# EAGLE design sop-dip-8 (EAGLE 4.16)
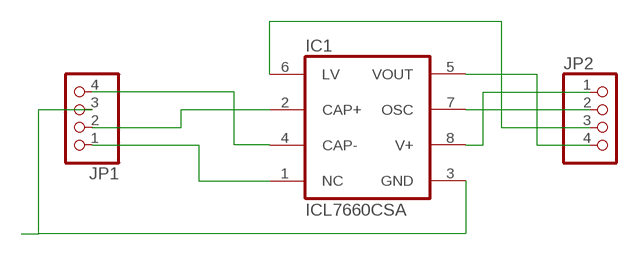
[diagram p0: schematic, sheet 1]

## Parts
IC1  ICL7660CSA  [SO08]
JP1  PINHD-1X4  [1X04]
JP2  PINHD-1X4  [1X04]

## Nets
N$1: IC1.1(NC) JP1.1
N$2: IC1.2(CAP+) JP1.2
N$3: IC1.3(GND) JP1.3
N$4: IC1.4(CAP-) JP1.4
N$5: IC1.5(VOUT) JP2.4
N$6: IC1.6(LV) JP2.3
N$7: IC1.7(OSC) JP2.2
N$8: IC1.8(V+) JP2.1

## Library data of the parts
IC1 = maxim-9:ICL7660CSA: VOLTAGE CONVERTER
JP1 JP2 = pinhead:PINHD-1X4: PIN HEADER

## Board
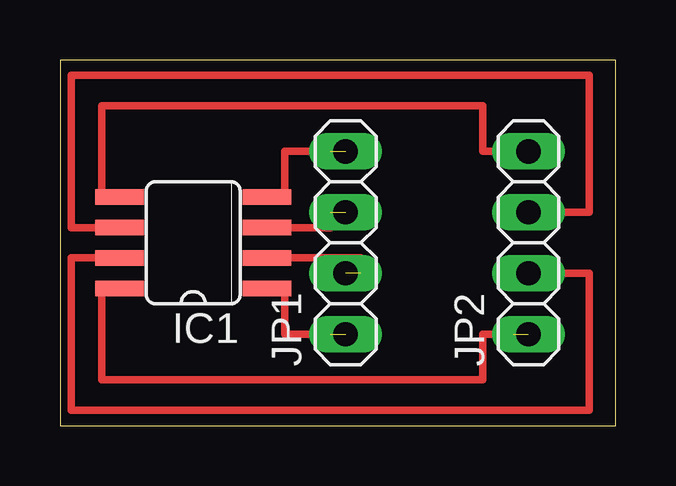
[diagram p1: board, top side]

Size 23.16 x 15.23 mm. Coordinates in mm from the lower left corner, seen from the top.
Outline: 0,0 23.16,0 23.16,15.23 0,15.23 0,0
Copper layers (1*16): Top 0.035mm / dielectric 1.5mm / Bottom 0.035mm
Design rules "default": minimum track width 10mil, minimum drill 24mil, track to track 8mil, track to pad 8mil, pad to pad 8mil, via to via 8mil, smd to smd 8mil, copper to edge 40mil, drill to drill 8mil, minimum pad ring 10mil, minimum via ring 8mil, stop-mask expansion 4mil, vias tented up to drill 0mil, thermal gap 10mil

### Footprints (pad centres in the part's own frame; a part is rotated, then mirrored left to right if it is on the bottom)
SO08 = smd 0.66 x 2.032: 1 -1.905,-3.073; 2 -0.635,-3.073; 3 0.635,-3.073; 4 1.905,-3.073; 5 1.905,3.073; 6 0.635,3.073; 7 -0.635,3.073; 8 -1.905,3.073
1X04 = drill 1.016 long: 1 -3.81,0; 2 -1.27,0; 3 1.27,0; 4 3.81,0

### Placement (x,y rotation side)
IC1  5.55,7.62 90 top
JP1  11.9,7.62 90 top
JP2  19.52,7.62 90 top

### Tracks (layer width: path | path; a pad name or v marks a point on that pad's centre or on a via)
N$1  (1 unrouted)
  Top 0.305: IC1.1 9.36,5.71 9.36,3.81 11.27,3.81
N$2  (1 unrouted)
  Top 0.305: IC1.2 12.54,6.98 12.54,6.35
N$3  (1 unrouted)
  Top 0.305: IC1.3 11.27,8.25 11.27,8.88
N$4  (1 unrouted)
  Top 0.305: IC1.4 9.36,9.52 9.36,11.42 11.27,11.42
N$5
  Top 0.305: IC1.5 1.74,9.52 1.74,13.33 17.62,13.33 17.62,11.42 JP2.4
N$6
  Top 0.305: IC1.6 0.47,8.25 0.47,14.6 22.06,14.6 22.06,8.88 JP2.3
N$7
  Top 0.305: IC1.7 0.47,6.98 0.47,0.63 22.06,0.63 22.06,6.35 JP2.2
N$8  (1 unrouted)
  Top 0.305: IC1.8 1.74,5.71 1.74,1.9 17.62,1.9 17.62,3.81 18.89,3.81